# EAGLE design HB-UNI-Sen-PM_v2p1 (EAGLE 8.7.1)
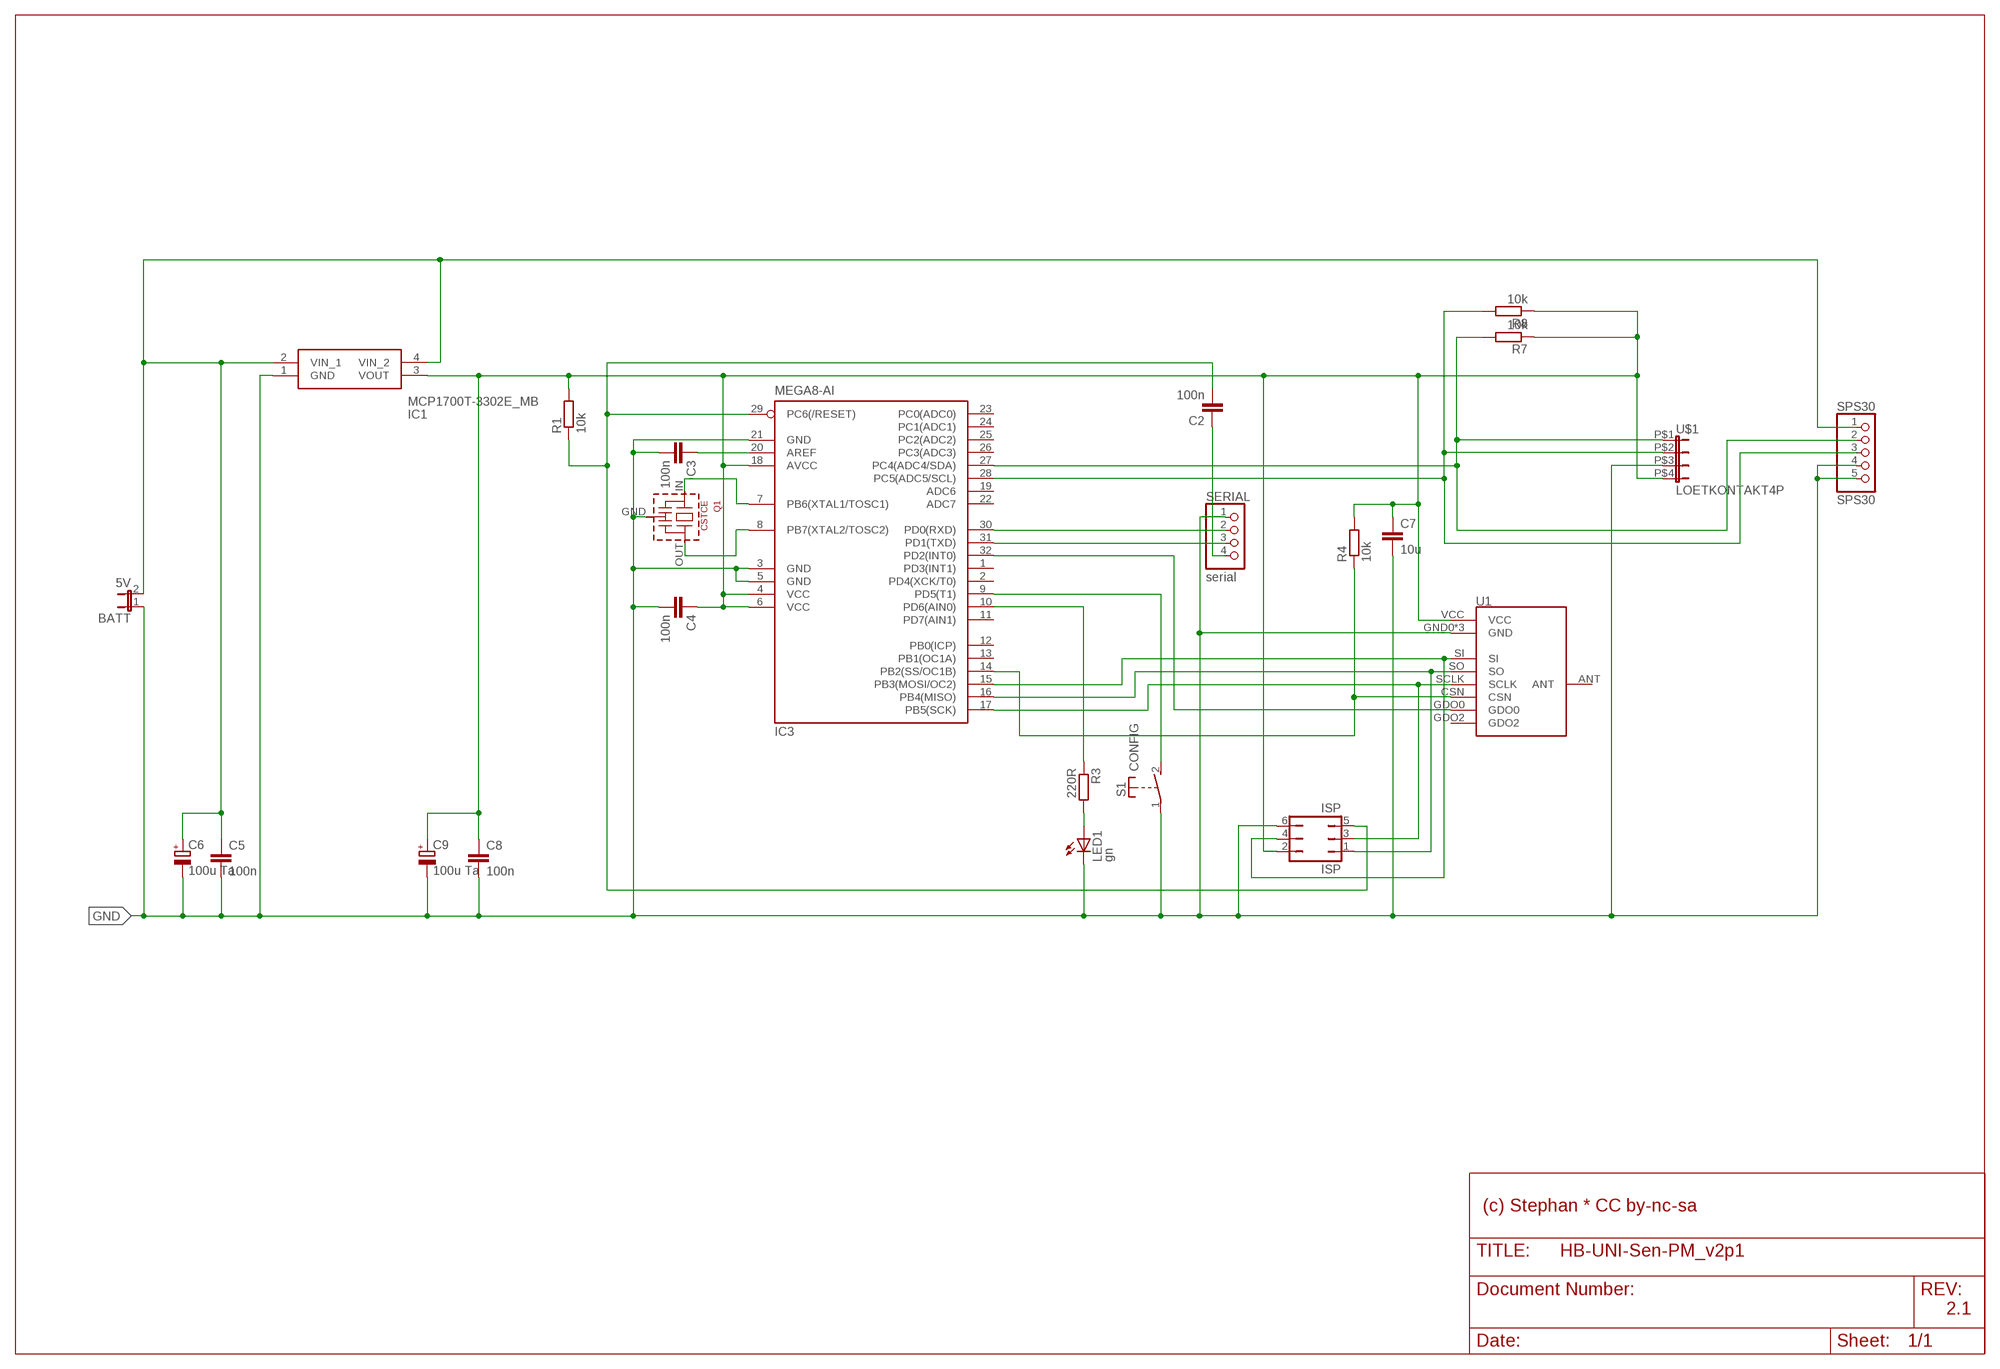
[diagram p0: schematic, sheet 1]

## Parts
BATT  5V  JP1E  [JP1]
C2  100n  C-EUC0805K  [C0805K]
C3  100n  C-EUC0805K  [C0805K]
C4  100n  C-EUC0805K  [C0805K]
C5  100n  C-EUC0805K  [C0805K]
C6  100u Ta  CPOL-EUSANYO_SMD_C6  [SANYO-OSCON_SMD_C6]
C7  10u  C-EUC0805K  [C0805K]
C8  100n  C-EUC0805K  [C0805K]
C9  100u Ta  CPOL-EUSANYO_SMD_C6  [SANYO-OSCON_SMD_C6]
IC1  MCP1700T-3302E_MB  [MCP1700T-3302E/MB]
IC3  MEGA8-AI  [TQFP32-08]
ISP  ISP  JP3Q  [JP3Q]
LED1  gn  LEDCHIPLED_0805  [CHIPLED_0805]
Q1  CSTCE  [CSTCE]
R1  10k  R-EU_R0805W  [R0805W]
R3  220R  R-EU_R0805W  [R0805W]
R4  10k  R-EU_R0805W  [R0805W]
R7  10k  R-EU_R0805W  [R0805W]
R8  10k  R-EU_R0805W  [R0805W]
S1  CONFIG  SMDSWITCH6X4  [SMDSWITCH6X4]
SERIAL  serial  PINHD-1X4  [1X04]
SPS30  SPS30  PINHD-1X5  [1X05]
U1  CC1101SMD  [CC1101-SMD]
U$1  LOETKONTAKT4P  [LOETKONTAKT4P]

## Nets
3V3: C4.1 C7.1 C8.1 C9.+ IC1.3(VOUT) IC3.4(VCC) IC3.6(VCC) IC3.18(AVCC) ISP.2 R1.2 R4.2 R7.1 R8.1 U1.VCC U$1.P$4
5V: BATT.2 C5.1 C6.+ IC1.2(VIN_1) IC1.4(VIN_2) SPS30.1
AREF: C3.1 IC3.20(AREF)
CSN: IC3.14(PB2(SS/OC1B)) R4.1 U1.CSN
DTR: C2.1 SERIAL.4
GDO0: IC3.32(PD2(INT0)) U1.GDO0
GND: BATT.1 C3.2 C4.2 C5.2 C6.- C7.2 C8.2 C9.- IC1.1(GND) IC3.3(GND) IC3.5(GND) IC3.21(GND) ISP.6 LED1.C Q1.GND S1.1(P) SERIAL.1 SPS30.4 SPS30.5 U1.GND0(GND) U1.GND1(GND) U1.GND2(GND) U$1.P$3
LED1: LED1.A R3.2
MISO: IC3.16(PB4(MISO)) ISP.1 U1.SO
MOSI: IC3.15(PB3(MOSI/OC2)) ISP.4 U1.SI
PD5: IC3.9(PD5(T1)) S1.2(S)
PD6: IC3.10(PD6(AIN0)) R3.1
RESET: C2.2 IC3.29(PC6(/RESET)) ISP.5 R1.1
RXD: IC3.30(PD0(RXD)) SERIAL.2
SCL: IC3.28(PC5(ADC5/SCL)) R8.2 SPS30.3 U$1.P$2
SCLK: IC3.17(PB5(SCK)) ISP.3 U1.SCLK
SDA: IC3.27(PC4(ADC4/SDA)) R7.2 SPS30.2 U$1.P$1
TXD: IC3.31(PD1(TXD)) SERIAL.3
XTAL1: IC3.7(PB6(XTAL1/TOSC1)) Q1.IN
XTAL2: IC3.8(PB7(XTAL2/TOSC2)) Q1.OUT
Unconnected: IC3.1(PD3(INT1)) IC3.2(PD4(XCK/T0)) IC3.11(PD7(AIN1)) IC3.12(PB0(ICP)) IC3.13(PB1(OC1A)) IC3.19(ADC6) IC3.22(ADC7) IC3.23(PC0(ADC0)) IC3.24(PC1(ADC1)) IC3.25(PC2(ADC2)) IC3.26(PC3(ADC3)) U1.ANT U1.GDO2

## Notes on the sheet
- (c) Stephan * CC by-nc-sa
- 2.1

## Library data of the parts
BATT = jumper:JP1E: JUMPER
C2-C5 C7 C8 = resistor:C-EU: CAPACITOR, European symbol
C6 C9 = rcl:CPOL-EU: POLARIZED CAPACITOR, European symbol; SPICEPREFIX: C
IC1 = SamacSys_Parts:MCP1700T-3302E_MB: LDO voltage regulator 250mA Isupply 1uA Source: Datasheet <http://ww1.microchip.com/downloads/en/DeviceDoc/20001826C.pdf>; ARROW_PART_NUMBER: MCP1700T-3302E/MB; ARROW_PRICE-STOCK: https://www.arrow.com/en/products/mcp1700t-3302emb/microchip-technology; DESCRIPTION: LDO voltage regulator 250mA Isupply 1uA; HEIGHT: mm; MANUFACTURER_NAME: Microchip; MANUFACTURER_PART_NUMBER: MCP1700T-3302E/MB; MOUSER_PART_NUMBER: 579-MCP1700T3302E/MB; MOUSER_PRICE-STOCK: https://www.mouser.co.uk/ProductDetail/Microchip-Technology/MCP1700T-3302E-MB/?qs=WWgnj3qycfnlJJhwyn%2Fifw%3D%3D
IC3 = atmel:MEGA8: MICROCONTROLLER 8 Kbytes FLASH, 1 kbytes SRAM, 512 bytes EEPROM, USART, 6-channel 10 bit ADC, 2-channel 8 bit ADC Pin compatible with Atmega48, ATMega88, ATMega168 Source: avr.lbr; MPN: ATMEGA8-16AU; OC_FARNELL: 9171371; OC_NEWARK: 73M8863
ISP = jumper:JP3Q: JUMPER
LED1 = led:LED: LED OSRAM: - CHIPLED LG R971, LG N971, LY N971, LG Q971, LY Q971, LO R971, LY R971 LH N974, LH R974 LS Q976, LO Q976, LY Q976 LO Q996 - Hyper CHIPLED LW Q18S LB Q993, LB Q99A, LB R99A - SideLED LS A670, LO A670, LY A670, LG A670, LP A670 LB A673, LV A673, LT A673, LW A673 LH A674 LY A675 LS A676, LA A676, LO A676, LY A676, LW A676 LS A679, LY A679, LG A679 - Hyper Micro SIDELED® LS Y876, LA Y876, LO Y876, LY Y876 LT Y87S - SmartLED LW L88C, LW L88S LB L89C, LB L89S, LG L890 LS L89K, LO L89K, LY L89K LS L896, LA L896, LO L896, LY L896 - TOPLED LS T670, LO T670, LY T670, LG T670, LP T670 LSG T670, LSP T670, LSY T670, LOP T670, LYG T670 LG T671, LOG T671, LSG T671 LB T673, LV T673, LT T673, LW T673 LH T674 LS T676, LA T676, LO T676, LY T676, LB T676, LH T676, LSB T676, LW T676 LB T67C, LV T67C, LT T67C, LS T67K, LO T67K, LY T67K, LW E67C LS E67B, LA E67B, LO E67B, LY E67B, LB E67C, LV E67C, LT E67C LW T67C LS T679, LY T679, LG T679 LS T770, LO T770, LY T770, LG T770, LP T770 LB T773, LV T773, LT T773, LW T773 LH T774 LS E675, LA E675, LY E675, LS T675 LS T776, LA T776, LO T776, LY T776, LB T776 LHGB T686 LT T68C, LB T68C - Hyper Mini TOPLED® LB M676 - Mini TOPLED Santana® LG M470 LS M47K, LO M47K, LY M47K Source: http://www.osram.convergy.de LUXEON: - LUMILED® LXK2-PW12-R00, LXK2-PW12-S00, LXK2-PW14-U00, LXK2-PW14-V00 LXK2-PM12-R00, LXK2-PM12-S00, LXK2-PM14-U00 LXK2-PE12-Q00, LXK2-PE12-R00, LXK2-PE12-S00, LXK2-PE14-T00, LXK2-PE14-U00 LXK2-PB12-K00, LXK2-PB12-L00, LXK2-PB12-M00, LXK2-PB14-N00, LXK2-PB14-P00, LXK2-PB14-Q00 LXK2-PR12-L00, LXK2-PR12-M00, LXK2-PR14-Q00, LXK2-PR14-R00 LXK2-PD12-Q00, LXK2-PD12-R00, LXK2-PD12-S00 LXK2-PH12-R00, LXK2-PH12-S00 LXK2-PL12-P00, LXK2-PL12-Q00, LXK2-PL12-R00 Source: www.luxeon.com KINGBRIGHT: KA-3528ASYC Source: www.kingbright.com
Q1 = murata-cstcc-cstce-cstcr-cstcv-resonators:CSTCE: Murata CSTCE Resonator - 3,2 x 1,3 mm
R1 R3 R4 R7 R8 = resistor:R-EU_: RESISTOR, European symbol
S1 = StephansLib:SMDSWITCH6X4: SMD button 6x4 mm
SERIAL = pinhead:PINHD-1X4: PIN HEADER
SPS30 = pinhead:PINHD-1X5: PIN HEADER
U1 = modules:CC1101
U$1 = StephansLib:LOETKONTAKT4P: Loetkontakt zur senkrechten Platinenverbindung 4polig

## Board
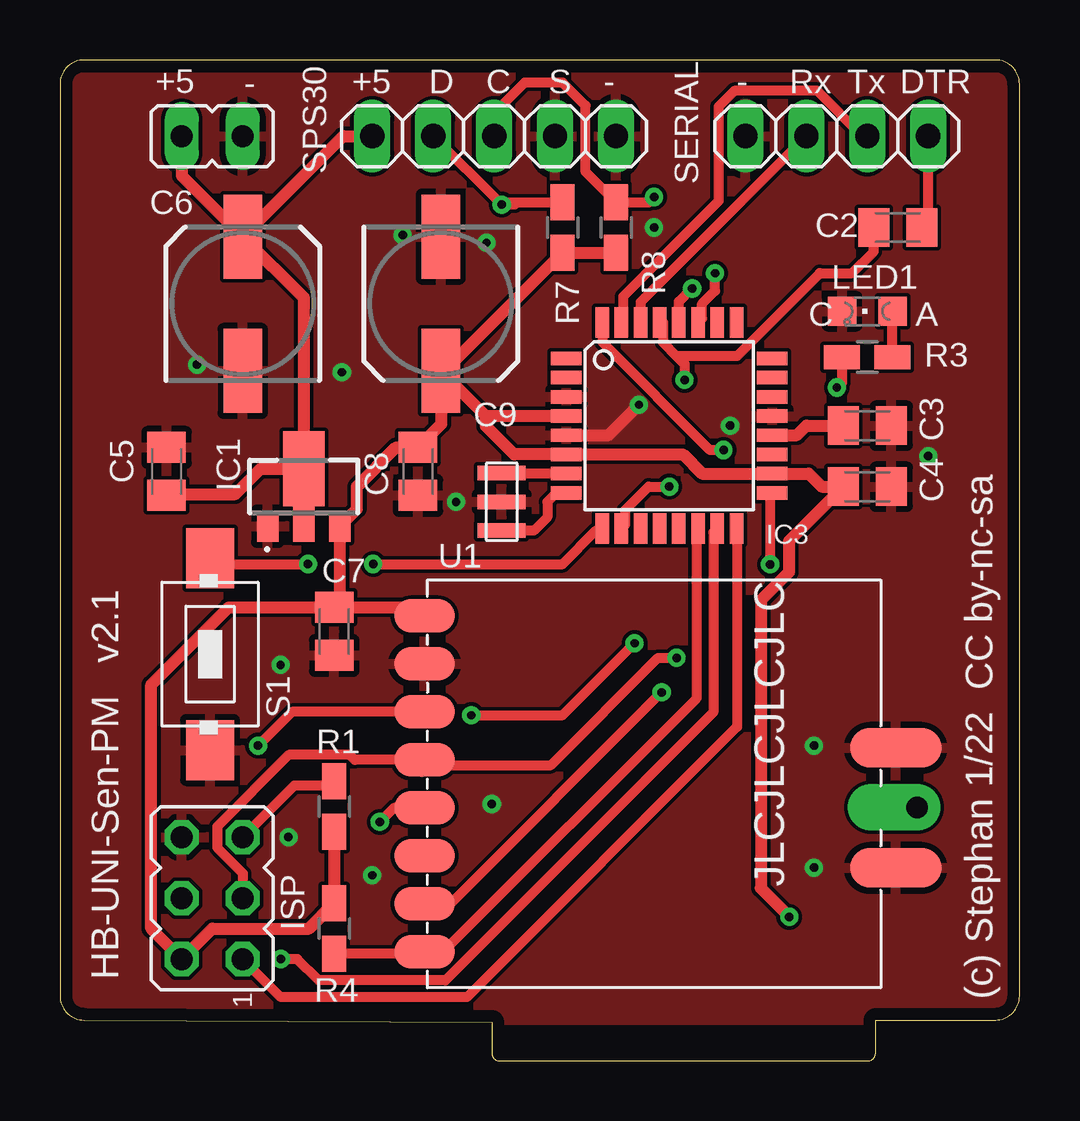
[diagram p1: board, top side]
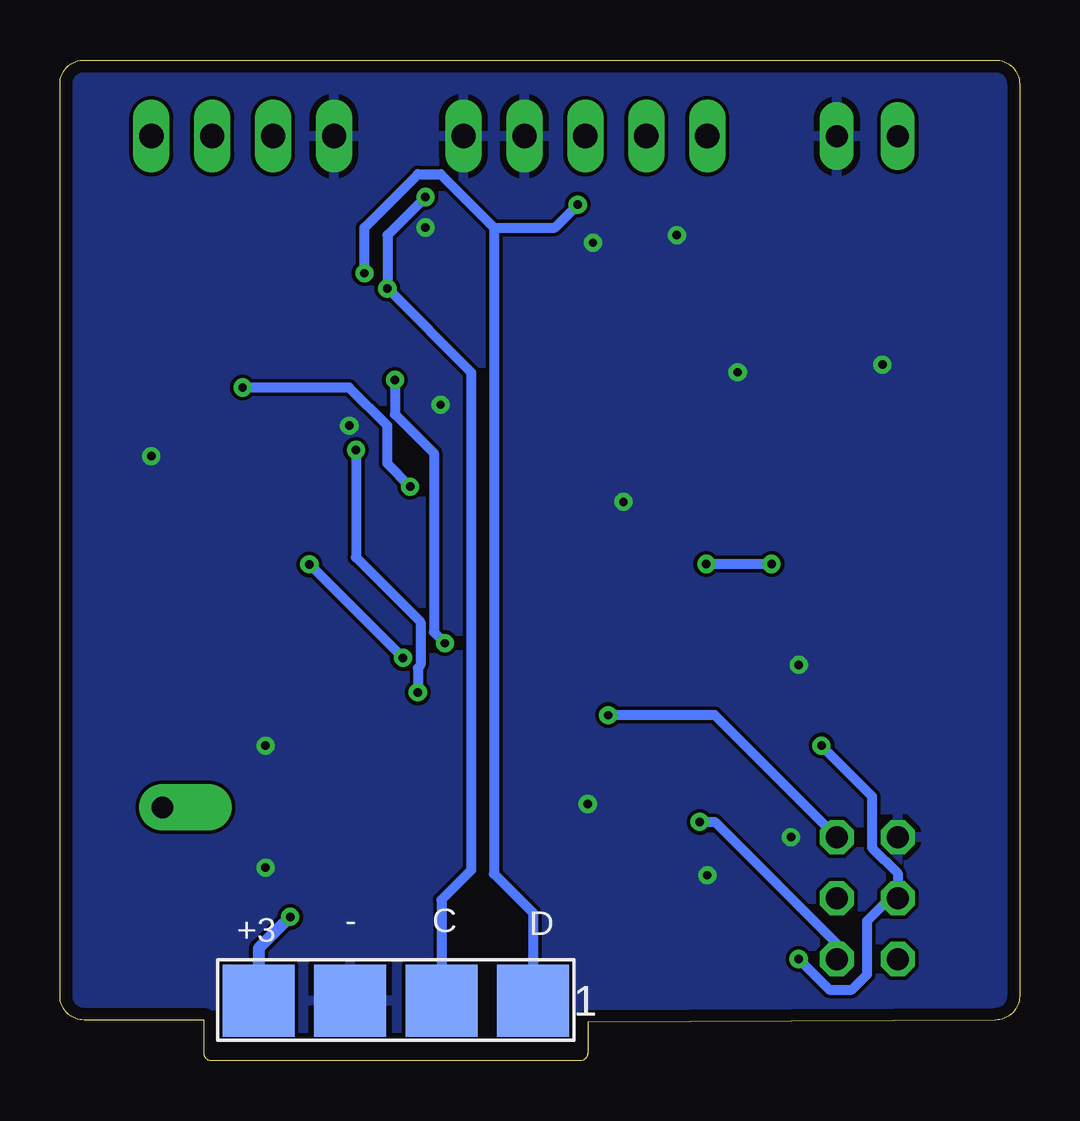
[diagram p2: board, bottom side, seen from below]

Size 40 x 41.7 mm. Coordinates in mm from the lower left corner, seen from the top.
Outline: 0,40.7 0,2.7 arc90 1,1.7 18,1.6 18,0.32 arc90 18.32,0 33.68,0 arc90 34,0.32 34,1.7 39,1.7 arc90 40,2.7 40,40.7 arc90 39,41.7 1,41.7 arc90 0,40.7
Copper layers (1*16): Top 0.035mm / dielectric 1.5mm / Bottom 0.035mm
Design rules "DRC17Jun21 *": minimum track width 16mil, minimum drill 0.35mm, track to track 6mil, track to pad 6mil, pad to pad 6mil, via to via 6mil, smd to smd 6mil, copper to edge 20mil, drill to drill 6mil, minimum pad ring 10mil, minimum via ring 8mil, stop-mask expansion 4mil, vias tented up to drill 16mil, thermal gap 10mil

### Footprints (pad centres in the part's own frame; a part is rotated, then mirrored left to right if it is on the bottom)
JP1 = drill 0.914 long: 1 0,-1.27; 2 0,1.27
C0805K = smd 1.3 x 1.6: 1 -1,0; 2 1,0
SANYO-OSCON_SMD_C6 = smd 3.5 x 1.6: + 2.8,0; - -2.8,0
MCP1700T-3302E/MB = smd 0.9 x 1.3: 1 -1.5,-1.65; 3 1.5,-1.65 | smd 0.9 x 1.475: 2 0,-1.562 | smd 1.733 x 3.125: 4 0,0.738
TQFP32-08 = smd 1.27 x 0.559: 1 -4.293,2.8; 2 -4.293,2; 3 -4.293,1.2; 4 -4.293,0.4; 5 -4.293,-0.4; 6 -4.293,-1.2; 7 -4.293,-2; 8 -4.293,-2.8; 17 4.293,-2.8; 18 4.293,-2; 19 4.293,-1.2; 20 4.293,-0.4; 21 4.293,0.4; 22 4.293,1.2; 23 4.293,2; 24 4.293,2.8 | smd 0.559 x 1.27: 9 -2.8,-4.293; 10 -2,-4.293; 11 -1.2,-4.293; 12 -0.4,-4.293; 13 0.4,-4.293; 14 1.2,-4.293; 15 2,-4.293; 16 2.8,-4.293; 25 2.8,4.293; 26 2,4.293; 27 1.2,4.293; 28 0.4,4.293; 29 -0.4,4.293; 30 -1.2,4.293; 31 -2,4.293; 32 -2.8,4.293
JP3Q = drill 0.914 octagon: 1 -2.54,-1.27; 2 -2.54,1.27; 3 0,-1.27; 4 0,1.27; 5 2.54,-1.27; 6 2.54,1.27
CHIPLED_0805 = smd 1.2 x 1.2: A 0,-1.05; C 0,1.05
CSTCE = smd 0.6 x 2: GND 0,0; IN 1.2,0; OUT -1.2,0
R0805W = smd 1.5 x 1: 1 -1.052,0; 2 1.052,0
SMDSWITCH6X4 = smd 2.5 x 2: 1 -4,2; 2 4,2
1X04 = drill 1.016 long: 1 -3.81,0; 2 -1.27,0; 3 1.27,0; 4 3.81,0
1X05 = drill 1.016 long: 1 -5.08,0; 2 -2.54,0; 3 0,0; 4 2.54,0; 5 5.08,0
CC1101-SMD = drill 0.9 pad 1.93 offset: ANT 10.965,-0.984 | smd 2.54 x 1.4: CSN -9.565,-7; GDO0 -9.565,-5; GDO2 -9.565,-3; GND0 -9.565,5; SCLK -9.565,1; SI -9.565,3; SO -9.565,-1; VCC -9.565,7 | smd 3.81 x 1.65: GND1 10.075,-3.5; GND2 10.075,1.5
LOETKONTAKT4P = smd 3 x 3: P$1 -5.715,0; P$2 -1.905,0; P$3 1.905,0; P$4 5.715,0

### Placement (x,y rotation side)
BATT  6.35,38.53 90 top
C2  34.92,34.72 180 top
C3  33.66,26.46 0 top
C4  33.66,23.93 0 top
C5  4.45,24.56 90 top
C6  7.62,31.54 90 top
C7  11.43,17.89 270 top
C8  14.92,24.56 270 top
C9  15.88,31.54 270 top
IC1  10.16,23.93 0 top
IC3  25.4,26.46 0 top
ISP  6.35,6.78 90 top
LED1  33.66,31.23 90 top
Q1  18.41,23.29 90 top
R1  11.43,10.59 270 top
R3  33.66,29.32 0 top
R4  11.43,5.51 90 top
R7  20.95,34.72 90 top
R8  23.18,34.72 90 top
S1  8.26,16.94 90 top
SERIAL  32.38,38.53 0 top
SPS30  18.1,38.53 0 top
U1  24.77,11.54 0 top
U$1  26,2.5 180 bottom

### Tracks (layer width: path | path; a pad name or v marks a point on that pad's centre or on a via)
3V3  (via drill 0.35)
  Top 0.508: R1.2 R4.2 10.38,5.51 6.35,5.51 ISP.2 3.81,5.51 3.81,15.67 7.03,18.89 C7.1 | R8.1 R7.1 16.51,29.22 C9.+ 15.9,28.72 | C7.1 11.66,18.8 IC1.3 12.38,23 12.38,23.93 14.02,25.56 C8.1 15.9,26.54 15.9,28.72 | IC3.4 17.75,26.86 | 17.75,26.86 15.9,28.72 | C7.1 14.85,18.89 U1.VCC | 17.75,26.86 17.75,26.45 18.93,25.27 IC3.6 25.96,25.27 26.77,24.46 IC3.18 31.21,24.46 31.75,23.93 C4.1 30.39,21.66 30.39,20.36 29.21,19.18 29.21,7.19 v30.4,6
  Bottom 0.508: v30.4,6 31.71,4.68 U$1.P$4
5V
  Top 0.508: C5.1 4.49,23.61 7.3,23.61 8.36,24.66 IC1.4 | IC1.4 IC1.2 | C6.+ 10.16,31.8 IC1.4 | C6.+ 11.8,38.53 SPS30.1 | BATT.2 5.08,36.89 C6.+
AREF
  Top 0.508: IC3.20 30.71,26.06 31.11,26.46 C3.1
CSN
  Top 0.406: R4.1 14.97,4.46 U1.CSN 15.37,4.49 15.93,4.49 26.54,15.11 26.54,22.1 IC3.14
DTR
  Top 0.406: C2.1 36.2,34.99 SERIAL.4
GDO0  (via drill 0.35)
  Top 0.406: v27.66,25.45 27.1,25.45 22.63,29.92 22.63,30.76 IC3.32 | 15.37,6.17 U1.GDO0 16.27,6.54 v25.08,15.35
  Bottom 0.406: v27.66,25.45 27.66,20.98 24.97,18.29 24.97,16.48 25.08,16.37 v25.08,15.35
GND  (via drill 0.35)
  Top 0.508: IC3.5 22.86,26.06 v24.14,27.34
  other vias: 36.2,25.2 9.2,16.5 16.51,23.29 14.29,34.4 11.75,28.69 31.43,13.13 31.43,8.05 9.53,9.32 13.02,7.73 27.94,26.46 24.77,34.72 5.71,29 17.78,34.09 18,10.7
  pour Top: 0,1.7 0,41.71 40.01,41.71 40.01,1.7
  pour Bottom: 0,41.71 40.64,41.71 40.64,1.38 -0.64,1.38 -0.64,41.71
LED1
  Top 0.406: R3.2 LED1.A
MISO  (via drill 0.35)
  Top 0.406: IC3.16 28.22,22.1 28.22,13.91 16.96,2.65 9.21,2.65 ISP.1 | 15.93,10.08 15.37,10.08 U1.SO 13.92,10.54 v13.34,9.96
  Bottom 0.406: v13.34,9.96 12.7,9.96 7.62,4.88 ISP.1
MOSI  (via drill 0.35)
  Top 0.406: 27.38,22.38 IC3.15 27.23,22.01 27.23,14.51 16.07,3.35 10.78,3.35 9.89,4.24 v9.21,4.24 | 15.37,14.27 U1.SI 9.67,14.54 v8.26,13.13
  Bottom 0.406: v9.21,4.24 7.94,2.97 6.99,2.97 6.35,3.6 6.35,5.83 5.4,6.78 ISP.4 5.08,7.81 6.15,8.88 6.15,11.02 v8.26,13.13
PD5  (via drill 0.35)
  Top 0.406: v13.06,20.7 20.95,20.7 22.35,22.1 IC3.9 | v10.34,20.7 6.43,20.7 S1.2
  Bottom 0.406: v10.34,20.7 v13.06,20.7
PD6  (via drill 0.35)
  Top 0.406: IC3.10 23.57,22.34 23.57,22.95 24.54,23.93 v25.4,23.93 | R3.1 32.6,28.27 v32.38,28.05
  Bottom 0.406: v25.4,23.93 26.35,24.88 26.35,26.46 27.94,28.05 v32.38,28.05
RESET  (via drill 0.35)
  Top 0.406: ISP.5 9.78,11.48 11.18,11.48 R1.1 | 25.7,29.36 25.15,29.92 25.15,30.76 IC3.29 | 25.7,29.36 28.22,29.36 28.63,29.77 28.84,29.97 28.84,29.98 31.67,32.81 33.02,32.81 33.92,33.72 C2.2 34.29,35.09 | 25.7,29.36 26.04,29.03 v26.04,28.37 | v17.14,14.4 20.95,14.4 v23.95,17.4
  Bottom 0.406: v26.04,28.37 26.04,26.94 24.41,25.31 24.41,17.86 v23.95,17.4 | ISP.5 12.7,14.4 v17.14,14.4
RXD
  Top 0.406: SERIAL.2 24.2,31.61 IC3.30
SCL  (via drill 0.35)
  Top 0.406: 25.7,30.76 IC3.28 25.8,31.63 v26.35,32.18 | SPS30.3 18.1,39.48 19.37,40.75 20.95,40.75 21.91,39.8 21.91,37.04 R8.2 24.55,35.77 v24.77,35.99
  Bottom 0.406: v24.77,35.99 26.35,34.4 v26.35,32.18 22.86,28.69 22.86,7.94 24.09,6.71 U$1.P$2
SCLK  (via drill 0.35)
  Top 0.406: v29.6,20.69 29.62,20.7 29.62,23.49 IC3.17 | U1.SCLK 15.37,12.32 20.46,12.32 24.93,16.79 v25.7,16.79 | 15.09,12.04 U1.SCLK | ISP.3 7.62,7.81 6.55,8.88 6.55,9.76 9.54,12.75 12.08,12.75 12.28,12.54 U1.SCLK
  Bottom 0.406: v25.7,16.79 v29.6,20.69
SDA  (via drill 0.35)
  Top 0.406: 26.54,30.76 IC3.27 26.77,30.92 26.77,31.54 27.3,32.08 v27.3,32.81 | 20.74,35.99 R7.2 19.05,35.77 | SPS30.2 18.32,35.77 19.05,35.77 | 19.05,35.77 18.95,35.67 v18.41,35.67
  Bottom 0.406: v27.3,32.81 27.3,34.72 25.08,36.94 24.13,36.94 21.91,34.72 | 21.91,34.72 19.37,34.72 v18.41,35.67 | 21.91,34.72 21.91,7.79 20.29,6.17 U$1.P$1
TXD
  Top 0.406: IC3.31 23.47,30.76 23.47,31.84 27.46,35.83 27.46,39.76 28.11,40.41 31.58,40.41 33.46,38.53 SERIAL.3
XTAL1
  Top 0.406: IC3.7 18.44,24.46 Q1.IN
XTAL2
  Top 0.406: IC3.8 20.7,23.66 20.32,23.29 20.32,22.65 19.75,22.09 Q1.OUT

### Text on the board
tNames: +5 | - | +5 | D | C | S | - | - | Rx | Tx | DTR | C | A | JLCJLCJLCJLC | HB-UNI-Sen-PM v2.1 | (c) Stephan 1/22 CC by-nc-sa
bNames: D | C | - | +3